# EAGLE design Adafruit PiTFT+ 3.2in (EAGLE 6.6.0)
REV: C
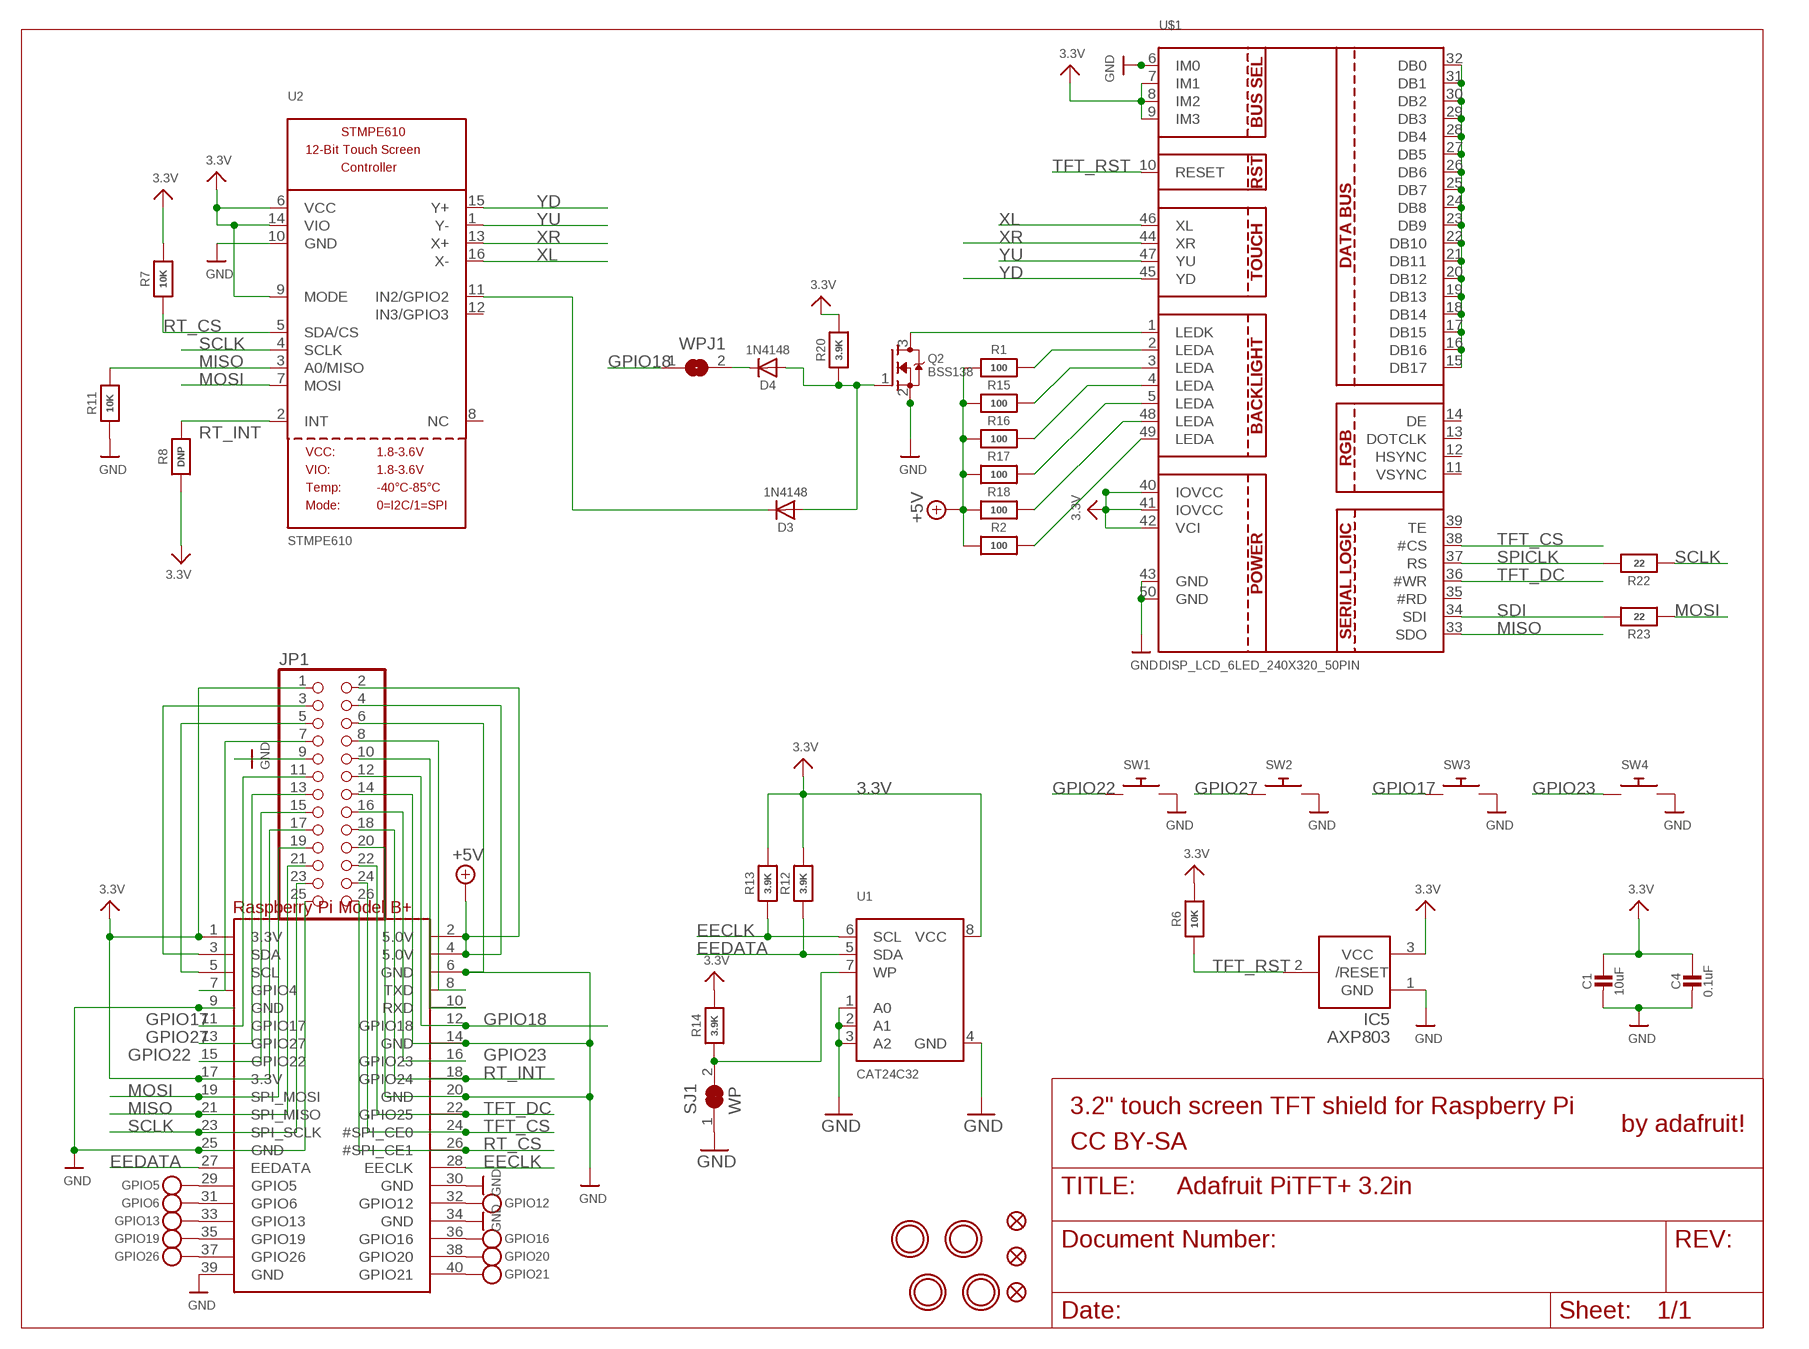
[diagram p0: schematic, sheet 1]

## Parts
C1  10uF  CAP_CERAMIC0805-NOOUTLINE  [0805-NO]
C4  0.1uF  CAP_CERAMIC0805-NOOUTLINE  [0805-NO]
D3  1N4148  DIODESOD-323  [SOD-323]
D4  1N4148  DIODESOD-323  [SOD-323]
GPIO5  TESTPOINT1.5X2.0MM_NOCREAM  [PAD-1.5X2.0]
GPIO6  TESTPOINT1.5X2.0MM_NOCREAM  [PAD-1.5X2.0]
GPIO12  TESTPOINT1.5X2.0MM_NOCREAM  [PAD-1.5X2.0]
GPIO13  TESTPOINT1.5X2.0MM_NOCREAM  [PAD-1.5X2.0]
GPIO16  TESTPOINT1.5X2.0MM_NOCREAM  [PAD-1.5X2.0]
GPIO19  TESTPOINT1.5X2.0MM_NOCREAM  [PAD-1.5X2.0]
GPIO20  TESTPOINT1.5X2.0MM_NOCREAM  [PAD-1.5X2.0]
GPIO21  TESTPOINT1.5X2.0MM_NOCREAM  [PAD-1.5X2.0]
GPIO26  TESTPOINT1.5X2.0MM_NOCREAM  [PAD-1.5X2.0]
IC5  AXP803  AXP083-SAG  [SOT23]
JP1  HEADER-2X13-SMT  [2X13_SMT_MALE]
Q2  BSS138  MOSFET-NWIDE  [SOT23-WIDE]
R1  100  RESISTOR0805_NOOUTLINE  [0805-NO]
R2  100  RESISTOR0805_NOOUTLINE  [0805-NO]
R6  10K  RESISTOR0805_NOOUTLINE  [0805-NO]
R7  10K  RESISTOR0805_NOOUTLINE  [0805-NO]
R8  DNP  RESISTOR0805_NOOUTLINE  [0805-NO]
R11  10K  RESISTOR0805_NOOUTLINE  [0805-NO]
R12  3.9K  RESISTOR0805_NOOUTLINE  [0805-NO]
R13  3.9K  RESISTOR0805_NOOUTLINE  [0805-NO]
R14  3.9K  RESISTOR0805_NOOUTLINE  [0805-NO]
R15  100  RESISTOR0805_NOOUTLINE  [0805-NO]
R16  100  RESISTOR0805_NOOUTLINE  [0805-NO]
R17  100  RESISTOR0805_NOOUTLINE  [0805-NO]
R18  100  RESISTOR0805_NOOUTLINE  [0805-NO]
R20  3.9K  RESISTOR0805_NOOUTLINE  [0805-NO]
R22  22  RESISTOR0805_NOOUTLINE  [0805-NO]
R23  22  RESISTOR_0805MP  [_0805MP]
RPI1  RASPBERRYPI_BPLUS_SMT  [RASPBERRYPI_BPLUS_SHIELD_SMT]
SJ1  WP  SOLDERJUMPER_CLOSED  [SOLDERJUMPER_CLOSEDWIRE]
SW1  SWITCH_PUSHBUTTONEVQ-PE  [TACT_PANA-EVQ]
SW2  SWITCH_PUSHBUTTONEVQ-PE  [TACT_PANA-EVQ]
SW3  SWITCH_PUSHBUTTONEVQ-PE  [TACT_PANA-EVQ]
SW4  SWITCH_PUSHBUTTONEVQ-PE  [TACT_PANA-EVQ]
U1  CAT24C32  EEPROM_I2C_SOIC8_GENERIC  [SOIC8_150MIL]
U2  STMPE610  [QFN16_3MM]
U$1  DISP_LCD_6LED_240X320_50PIN  [TFT_3.2IN_240X320_50PIN]
U$10  FIDUCIAL""  [FIDUCIAL_1MM]
U$11  FIDUCIAL""  [FIDUCIAL_1MM]
U$15  MOUNTINGHOLE2.5_THICK  [MOUNTINGHOLE_2.5_PLATED_THICK]
U$16  MOUNTINGHOLE2.5_THICK  [MOUNTINGHOLE_2.5_PLATED_THICK]
U$17  MOUNTINGHOLE2.5_THICK  [MOUNTINGHOLE_2.5_PLATED_THICK]
U$18  FIDUCIAL""  [FIDUCIAL_1MM]
U$20  MOUNTINGHOLE2.5_THICK  [MOUNTINGHOLE_2.5_PLATED_THICK]
WPJ1  SOLDERJUMPERCLOSED  [SOLDERJUMPER_CLOSEDWIRE]

## Nets
3.3V: C1.1 C4.1 IC5.3(VCC) JP1.1 JP1.17 R6.2 R7.2 R8.1 R12.2 R13.2 R14.2 R20.2 RPI1.1(3.3V) RPI1.17(3.3V) U1.8(VCC) U2.6(VCC) U2.9(MODE) U2.14(VIO) U$1.7(IM1) U$1.8(IM2) U$1.9(IM3) U$1.40(IOVCC) U$1.41(IOVCC) U$1.42(VCI)
+5V: JP1.2 JP1.4 R1.1 R2.1 R15.1 R16.1 R17.1 R18.1 RPI1.2(5.0V) RPI1.4(5.0V)
EECLK: R13.1 RPI1.28(EECLK) U1.6(SCL)
EEDATA: R12.1 RPI1.27(EEDATA) U1.5(SDA)
GND: C1.2 C4.2 IC5.1(GND) JP1.6 JP1.9 JP1.14 JP1.20 JP1.25 Q2.2(S) R11.1 RPI1.6(GND) RPI1.9(GND) RPI1.14(GND) RPI1.20(GND) RPI1.25(GND) RPI1.30(GND) RPI1.34(GND) RPI1.39(GND) SJ1.1 SW1.P$2 SW2.P$2 SW3.P$2 SW4.P$2 U1.1(A0) U1.2(A1) U1.3(A2) U1.4(GND) U2.10(GND) U$1.6(IM0) U$1.43(GND) U$1.50(GND)
GPIO6: GPIO6.P$1 RPI1.31(GPIO6)
GPIO16: GPIO16.P$1 RPI1.36(GPIO16)
GPIO17: JP1.11 RPI1.11(GPIO17) SW3.P$1
GPIO18: JP1.12 RPI1.12(GPIO18) WPJ1.1
GPIO22: JP1.15 RPI1.15(GPIO22) SW1.P$1
GPIO23: JP1.16 RPI1.16(GPIO23) SW4.P$1
GPIO27: JP1.13 RPI1.13(GPIO27) SW2.P$1
MISO: JP1.21 R11.2 RPI1.21(SPI_MISO) U2.3(A0/MISO) U$1.33(SDO)
MOSI: JP1.19 R23.1 RPI1.19(SPI_MOSI) U2.7(MOSI)
N$1: R2.2 U$1.49(LEDA)
N$2: R1.2 U$1.2(LEDA)
N$3: D3.C U2.11(IN2/GPIO2)
N$5: GPIO5.P$1 RPI1.29(GPIO5)
N$6: JP1.3 RPI1.3(SDA)
N$7: JP1.5 RPI1.5(SCL)
N$8: JP1.7 RPI1.7(GPIO4)
N$9: GPIO13.P$1 RPI1.33(GPIO13)
N$10: GPIO19.P$1 RPI1.35(GPIO19)
N$13: GPIO26.P$1 RPI1.37(GPIO26)
N$14: GPIO12.P$1 RPI1.32(GPIO12)
N$15: GPIO20.P$1 RPI1.38(GPIO20)
N$16: R14.1 SJ1.2 U1.7(WP)
N$17: JP1.10 RPI1.10(RXD)
N$18: JP1.8 RPI1.8(TXD)
N$19: GPIO21.P$1 RPI1.40(GPIO21)
N$20: D3.A D4.A Q2.1(G) R20.1
N$21: U$1.15(DB17) U$1.16(DB16) U$1.17(DB15) U$1.18(DB14) U$1.19(DB13) U$1.20(DB12) U$1.21(DB11) U$1.22(DB10) U$1.23(DB9) U$1.24(DB8) U$1.25(DB7) U$1.26(DB6) U$1.27(DB5) U$1.28(DB4) U$1.29(DB3) U$1.30(DB2) U$1.31(DB1) U$1.32(DB0)
N$22: Q2.3(D) U$1.1(LEDK)
N$23: R15.2 U$1.3(LEDA)
N$24: R16.2 U$1.4(LEDA)
N$25: R17.2 U$1.5(LEDA)
N$26: R18.2 U$1.48(LEDA)
N$28: D4.C WPJ1.2
RT_CS: JP1.26 R7.1 RPI1.26(#SPI_CE1) U2.5(SDA/CS)
RT_INT: JP1.18 R8.2 RPI1.18(GPIO24) U2.2(INT)
SCLK: JP1.23 R22.1 RPI1.23(SPI_SCLK) U2.4(SCLK)
SDI: R23.2 U$1.34(SDI)
SPICLK: R22.2 U$1.37(RS)
TFT_CS: JP1.24 RPI1.24(#SPI_CE0) U$1.38(#CS)
TFT_DC: JP1.22 RPI1.22(GPIO25) U$1.36(#WR)
TFT_RST: IC5.2(/RESET) R6.1 U$1.10(RESET)
XL: U2.16(X-) U$1.46(XL)
XR: U2.13(X+) U$1.44(XR)
YD: U2.15(Y+) U$1.45(YD)
YU: U2.1(Y-) U$1.47(YU)
Unconnected: U2.8(NC) U2.12(IN3/GPIO3) U$1.11(VSYNC) U$1.12(HSYNC) U$1.13(DOTCLK) U$1.14(DE) U$1.35(#RD) U$1.39(TE)

## Notes on the sheet
- 3.2" touch screen TFT shield for Raspberry Pi
- by adafruit!
- CC BY-SA

## Library data of the parts
C1 C4 = microbuilder:CAP_CERAMIC: Ceramic Capacitors For new designs, use the packages preceded by an '_' character since they are more reliable: The following footprints should be used on most boards: _0402 - Standard footprint for regular board layouts _0603 - Standard footprint for regular board layouts _0805 - Standard footprint for regular board layouts _1206 - Standard footprint for regular board layouts For extremely tight-pitch boards where space is at a premium, the following 'micro-pitch' footprints can be used (smaller pads, no silkscreen outline, etc.): _0402MP - Micro-pitch footprint for very dense/compact boards _0603MP - Micro-pitch footprint for very dense/compact boards _0805MP - Micro-pitch footprint for very dense/compact boards _1206MP - Micro-pitch footprint for very dense/compact boards
D3 D4 = microbuilder:DIODE: Diode SMA Model Volts Amps Type Vf Ir Digikey # Notes SSA34-E3 40V 3A Schottky 480mV @ 3A 200uA @ 40V SSA34-E3/61TGITR-ND CDBA120-G 20V 1A Schottky 500mV @ 1A 500uA @ 20V 641-1014-6-ND REEL MBRA210 10V 2A Schottky 350mV @ 2A 700uA @ 10V MBRA210LT3 SOD-123 Model Volts Amps Type Vf Ir Order # Notes BAT54T1G 30V 200mA Schottky 800mV @ 200mA 2uA @ 25V BAT54T1GOSTR-ND B0530W 30V 500mA Schottky 430mV @ 500mA 130uA @ 30V B0530W-FDICT-ND REEL MBR120 20V 1A Schottky 340mV @ 1A MBR120VLSFT1GOSCT-ND SOD-323 Model Volts Amps Type Vf Ir Order # Notes PMEG2005EJ 20V 500mA Schottky 355mV @ 500mA 568-4110-1-ND ZLLS410 10V 570mA Schottky 380mV @ 570mA ZLLS410CT-ND 1N4148WS 75V 150mA Silicon/Simple 1V 1N4148WSFSCT-ND REEL SOD-523 Model Volts Amps Type Vf Ir Order # Notes BAT54XV2 30V 200mA Schottky 0.8V @ 100mA BAT54XV2CT-ND TB751S 30V 30mA Schottky RB751S-40TE61CT-ND SOT23-R/W (R = Solder Paste/Reflow Ovens, W = Hand-Soldering) Model Volts Amps Type Vf Ir Order # Notes BAT54FILM 40V 300mA Schottky 497-7162-1-ND POWERDI-5 Model Volts Amps Type Vf Ir Order # Notes PDS560 60V 5A Schottky 670mV @ 5A 150uA @ 60V PDS560DICT-ND
GPIO5 GPIO6 GPIO12 GPIO13 GPIO16 GPIO19-GPIO21 GPIO26 = microbuilder:TESTPOINT: Test Point Various test points for characterisation and PCB testing TESTPOINT_SMT - Compact Surface Mount Test Point [Digikey: 5016KTR-ND]
IC5 = adafruit:AXP083
JP1 = microbuilder:HEADER-2X13
Q2 = microbuilder:MOSFET-N: N-Channel Mosfet LEGEND VDS: Voltage Drain-Source ID: Drain Current RDS(ON): Drain-Source On-State Resistance VGS(TH): Gate-Source Threshold Voltage CISS: Drain-Source Input Capacitance SOT-23 Name VDS ID RDS(ON) VGS(TH) CISS Order Number 2N7002E 60V 260mA 2.5 Ohm 2.5V @ 250uA 26.7pF @ 25V 2N7002ET1GOSTR-ND BSH103 30V 850mA 400 mOhm 400mV @ 1mA 83pF @ 24V BSH103,235-ND BSS138 60V 320mA 1.6 Ohm 1.5V @ 250uA 50pF @ 10V Mouser: 771-BSS138PW115 DMN2075U-7 20V 4.2A 38 mOhm 1V @ 250 uA 594.3pF @ 10V DMN2075U-7DICT-ND * BSS138 good choice for I2C level-shifting POWERPAK 1212-8 Name VDS ID RDS(ON) VGS(TH) CISS Order Number Si7308DN 60V 6A 58 mOhm 3V @ 250uA 665pF @ 15V SI7308DN-T1-E3CT-ND
R1 R2 R6-R8 R11-R18 R20 R22 R23 = microbuilder:RESISTOR: Resistors For new designs, use the packages preceded by an '_' character since they are more reliable: The following footprints should be used on most boards: _0402 - Standard footprint for regular board layouts _0603 - Standard footprint for regular board layouts _0805 - Standard footprint for regular board layouts _1206 - Standard footprint for regular board layouts For extremely tight-pitch boards where space is at a premium, the following 'micro-pitch' footprints can be used (smaller pads, no silkscreen outline, etc.): _0402MP - Micro-pitch footprint for very dense/compact boards _0603MP - Micro-pitch footprint for very dense/compact boards _0805MP - Micro-pitch footprint for very dense/compact boards _1206MP - Micro-pitch footprint for very dense/compact boards
RPI1 = microbuilder:RASPBERRYPI_BPLUS
SJ1 = microbuilder:SOLDERJUMPER_CLOSED: Solder Jumper - Closed These solder jumpers are closed by default CLOSEDWIRE - 10 mil trace between pads that can be cut and resoldered later CLOSEDPERM - 63 mil trace between pads for a permanent connection (used to 'bridge' two signals, a shameless hack for Eagle). Can double as a test point as well (no cream layer)
SW1-SW4 = microbuilder:SWITCH_PUSHBUTTON: Buttons SOFTTOUCHSMD_SJ - Soft touch temporary push button (Super Junk Akihabara) Compatible with SKPMANE010 [Mouser: 688-SKPMAN] C&K_KSS = Digikey: KSS221GLFS
U1 = microbuilder:EEPROM_I2C_SOIC8_GENERIC: Note: The same pinout is used for many I2C EEPROMs in SOIC8(150mil) from a variety of manufacturers and in various sizes. Examples: 16K (2K x 8 Bit) I2C EEPROM 1.7-5.5V, 400KHz, -40°C-85°C Digikey: CAT24C16WI-GT3CT-ND 256K (32K x 8 Bit) I2C EEPROM 1.7-5.5V, 400KHz, -40°C-85°C Digikey: 24AA256-I/SN-ND
U2 = microbuilder:STMPE610: STMPE610 - 12-Bit Touch Screen Controller
U$1 = microbuilder:DISP_LCD_6LED_240X320_50PIN
U$10 U$11 U$18 = microbuilder:FIDUCIAL: Fiducial Alignment Points Various fiducial points for machine vision alignment.; BOM: EXCLUDE
U$15-U$17 U$20 = microbuilder:MOUNTINGHOLE: Mounting Hole For #2 screws (0.086"/2.18mm width, 0.094"/2.4mm hole) use 2.5mm; BOM: EXCLUDE
WPJ1 = microbuilder:SOLDERJUMPER: SMD Solder JUMPER Solder the two pads together to create a connection, or remove the solder to break it. REFLOW - Use this footprint for solder paste and reflow ovens. WAVE - Use this footprint for hand-soldering (larger pads). CLOSED - Has a trace between the two pads to ensure it is closed by default. The trace needs to be cut to disable the jumper, and can be closed again by creating a solder bridge between the two pads.

## Board
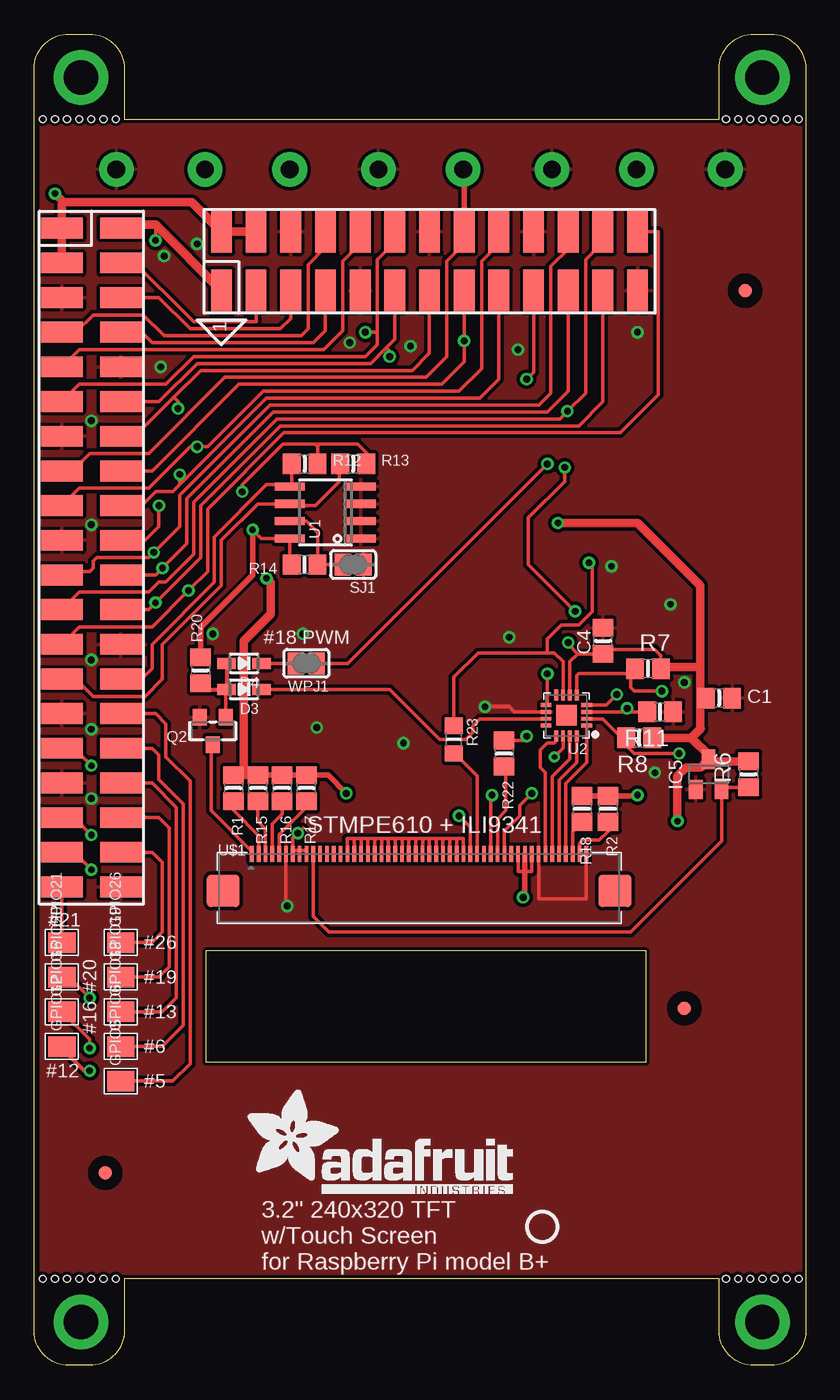
[diagram p1: board, top side]
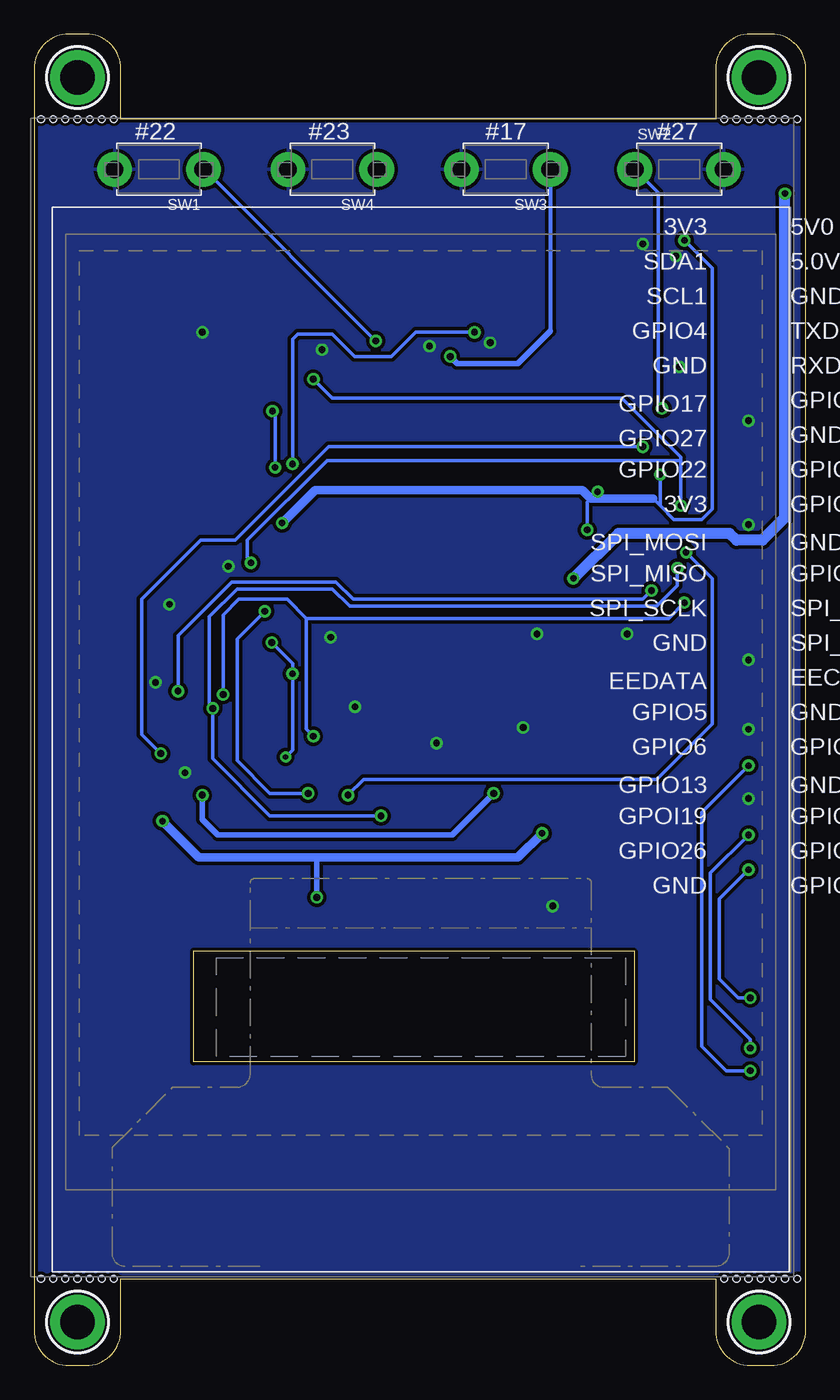
[diagram p2: board, bottom side, seen from below]

Size 56.52 x 97.54 mm. Coordinates in mm from the lower left corner, seen from the top.
Outline: 44.83,30.35 12.57,30.35 12.57,22.23 44.83,22.23 44.83,30.35
Outline: 6.6,6.35 6.6,2.54 arc-90 4.06,0 2.54,0 arc-90 0,2.54 0,95 arc-90 2.54,97.54 4.06,97.54 arc-90 6.6,95 6.6,91.31 50.16,91.31 50.16,95 arc-90 52.7,97.54 53.98,97.54 arc-90 56.52,95 56.52,2.54 arc-90 53.98,0 52.7,0 arc-90 50.16,2.54 50.16,6.35 6.6,6.35
Copper layers (1*16): Top 0.035mm / dielectric 1.5mm / Bottom 0.035mm
Design rules "adafruit *": minimum track width 8mil, minimum drill 15.5mil, track to track 8mil, track to pad 8mil, pad to pad 8mil, via to via 8mil, smd to smd 8mil, copper to edge 10mil, drill to drill 8mil, minimum pad ring 10mil, minimum via ring 8mil, stop-mask expansion 2mil, vias tented up to drill 20mil, thermal gap 10mil
Holes 0.5 mm at 5.97,91.31 5.08,91.31 4.19,91.31 3.3,91.31 2.41,91.31 1.52,91.31 0.64,91.31 56.01,91.31 55.12,91.31 54.23,91.31 53.34,91.31 52.45,91.31 51.56,91.31 50.67,91.31 5.97,6.35 5.08,6.35 4.19,6.35 3.3,6.35 2.41,6.35 1.52,6.35 0.64,6.35 56.01,6.35 55.12,6.35 54.23,6.35 53.34,6.35 52.45,6.35 51.56,6.35 50.67,6.35
tKeepout: area 23.9,39.5 to 24,39.9
tRestrict: area 19.1,37 to 19.3,37.3; area 20.1,37.3 to 20.3,37.7; area 20.6,37.3 to 20.8,37.7; area 21.1,37.3 to 21.3,37.7; area 21.6,37.3 to 21.8,37.7; area 22.1,37.3 to 22.3,37.7; area 22.6,37.3 to 22.8,37.7; area 23.1,37.3 to 23.3,37.7; area 23.6,37.3 to 23.7,37.7; area 24.1,37.3 to 24.3,37.7; area 24.6,37.3 to 24.8,37.7; area 25.1,37.3 to 25.3,37.7; 7 more areas

### Footprints (pad centres in the part's own frame; a part is rotated, then mirrored left to right if it is on the bottom)
0805-NO = smd 1.3 x 1.5: 1 -0.95,0; 2 0.95,0
SOD-323 = smd 1.35 x 0.8: A 1.27,0; C -1.27,0
PAD-1.5X2.0 = smd 1.5 x 2: P$1 0,0
SOT23 = smd 1 x 1.4: 1 -0.95,-1.1; 2 0.95,-1.1; 3 0,1.1
2X13_SMT_MALE = smd 1.524 x 3.048: 1 -15.24,-2.159; 2 -15.24,2.159; 3 -12.7,-2.159; 4 -12.7,2.159; 5 -10.16,-2.159; 6 -10.16,2.159; 7 -7.62,-2.159; 8 -7.62,2.159; 9 -5.08,-2.159; 10 -5.08,2.159; 11 -2.54,-2.159; 12 -2.54,2.159; 13 0,-2.159; 14 0,2.159; 15 2.54,-2.159; 16 2.54,2.159; 17 5.08,-2.159; 18 5.08,2.159; 19 7.62,-2.159; 20 7.62,2.159; 21 10.16,-2.159; 22 10.16,2.159; 23 12.7,-2.159; 24 12.7,2.159; 25 15.24,-2.159; 26 15.24,2.159
SOT23-WIDE = smd 1 x 1.2: 1 -0.95,-1; 2 0.95,-1; 3 0,1
_0805MP = smd 1.2 x 1.3: 1 -1.016,0; 2 1.016,0
RASPBERRYPI_BPLUS_SHIELD_SMT = smd 3.048 x 1.524 bottom: 1 50.419,76.835; 2 54.737,76.835; 3 50.419,74.295; 4 54.737,74.295; 5 50.419,71.755; 6 54.737,71.755; 7 50.419,69.215; 8 54.737,69.215; 9 50.419,66.675; 10 54.737,66.675; 11 50.419,64.135; 12 54.737,64.135; 13 50.419,61.595; 14 54.737,61.595; 15 50.419,59.055; 16 54.737,59.055; 17 50.419,56.515; 18 54.737,56.515; 19 50.419,53.975; 20 54.737,53.975; 21 50.419,51.435; 22 54.737,51.435; 23 50.419,48.895; 24 54.737,48.895; 25 50.419,46.355; 26 54.737,46.355; 27 50.419,43.815; 28 54.737,43.815; 29 50.419,41.275; 30 54.737,41.275; 31 50.419,38.735; 32 54.737,38.735; 33 50.419,36.195; 34 54.737,36.195; 35 50.419,33.655; 36 54.737,33.655; 37 50.419,31.115; 38 54.737,31.115; 39 50.419,28.575; 40 54.737,28.575
SOLDERJUMPER_CLOSEDWIRE = smd 1.168 x 1.6: 1 -0.762,0; 2 0.762,0 | smd 0.635 x 0.203: WIRE 0,0
TACT_PANA-EVQ = drill 1.3 pad 2.54: P$1 -3.25,0; P$2 3.25,0
SOIC8_150MIL = smd 0.6 x 2.2: 1 -1.905,-2.6; 2 -0.635,-2.6; 3 0.635,-2.6; 4 1.905,-2.6; 5 1.905,2.6; 6 0.635,2.6; 7 -0.635,2.6; 8 -1.905,2.6
QFN16_3MM = smd 0.8 x 0.28: 1 -1.5,0.75; 2 -1.5,0.25; 3 -1.5,-0.25; 4 -1.5,-0.75; 9 1.5,-0.75; 10 1.5,-0.25; 11 1.5,0.25; 12 1.5,0.75 | smd 0.28 x 0.8: 5 -0.75,-1.5; 6 -0.25,-1.5; 7 0.25,-1.5; 8 0.75,-1.5; 13 0.75,1.5; 14 0.25,1.5; 15 -0.25,1.5; 16 -0.75,1.5 | smd 1.5 x 1.5: THERMAL 0,0
TFT_3.2IN_240X320_50PIN = smd 0.275 x 1.2 bottom: 1 12.25,-9.39; 2 11.75,-9.39; 3 11.25,-9.39; 4 10.75,-9.39; 5 10.25,-9.39; 6 9.75,-9.39; 7 9.25,-9.39; 8 8.75,-9.39; 9 8.25,-9.39; 10 7.75,-9.39; 11 7.25,-9.39; 12 6.75,-9.39; 13 6.25,-9.39; 14 5.75,-9.39; 15 5.25,-9.39; 16 4.75,-9.39; 17 4.25,-9.39; 18 3.75,-9.39; 19 3.25,-9.39; 20 2.75,-9.39; 21 2.25,-9.39; 22 1.75,-9.39; 23 1.25,-9.39; 24 0.75,-9.39; 25 0.25,-9.39; 26 -0.25,-9.39; 27 -0.75,-9.39; 28 -1.25,-9.39; 29 -1.75,-9.39; 30 -2.25,-9.39; 31 -2.75,-9.39; 32 -3.25,-9.39; 33 -3.75,-9.39; 34 -4.25,-9.39; 35 -4.75,-9.39; 36 -5.25,-9.39; 37 -5.75,-9.39; 38 -6.25,-9.39; 39 -6.75,-9.39; 40 -7.25,-9.39; 41 -7.75,-9.39; 42 -8.25,-9.39; 43 -8.75,-9.39; 44 -9.25,-9.39; 45 -9.75,-9.39; 46 -10.25,-9.39; 47 -10.75,-9.39; 48 -11.25,-9.39; 49 -11.75,-9.39; 50 -12.25,-9.39 | smd 2.4 x 2.4 bottom: PAD1 14.35,-12.09; PAD2 -14.35,-12.09
FIDUCIAL_1MM = smd 1 x 1: 1 0,0
MOUNTINGHOLE_2.5_PLATED_THICK = drill 2.5 pad 4: P$1 0,0

### Placement (x,y rotation side)
C1  50.16,48.9 0 top
C4  41.66,53.09 90 top
D3  15.37,49.53 180 top
D4  15.37,51.44 180 top
GPIO5  6.35,20.83 90 top
GPIO6  6.35,23.37 90 top
GPIO12  2.03,23.37 90 top
GPIO13  6.35,25.91 90 top
GPIO16  2.03,25.91 90 top
GPIO19  6.35,28.45 90 top
GPIO20  2.03,28.45 90 top
GPIO21  2.03,30.99 90 top
GPIO26  6.35,30.99 90 top
IC5  49.4,43.31 0 top
JP1  28.96,80.9 0 top
Q2  13.08,46.48 180 top
R1  14.61,42.29 270 top
R2  42.04,40.77 270 top
R6  52.32,43.31 90 top
R7  44.96,51.05 0 top
R8  44.32,45.97 180 top
R11  45.85,47.88 180 top
R12  19.81,66.04 0 top
R13  23.37,66.04 0 top
R14  19.81,58.67 180 top
R15  16.38,42.29 270 top
R16  18.16,42.29 270 top
R17  19.94,42.29 270 top
R18  40.13,40.77 270 top
R20  12.19,50.93 90 top
R22  34.42,44.83 270 top
R23  30.73,45.85 270 top
RPI1  56.77,6.48 0 bottom
SJ1  23.37,58.67 180 top
SW1  47.37,87.63 180 bottom
SW2  9.27,87.63 0 bottom
SW3  21.97,87.63 180 bottom
SW4  34.67,87.63 180 bottom
U1  21.34,62.48 90 top
U2  38.99,47.62 180 top
U$1  28.19,46.86 0 bottom
U$10  47.62,26.16 90 top
U$11  5.21,14.1 180 top
U$15  3.43,3.17 90 bottom
U$16  53.34,94.36 90 bottom
U$17  53.34,3.17 0 bottom
U$18  52.07,78.74 0 top
U$19  [PCBFEAT-REV-056]  37.21,10.16 0 top
U$20  3.43,94.36 0 bottom
U$23  [ADAFRUIT_TEXT_20MM]  15.49,12.57 0 top
WPJ1  19.94,51.44 180 top

### Tracks (layer width: path | path; a pad name or v marks a point on that pad's centre or on a via)
3.3V  (via drill 0.39, 0.48, 0.5)
  Top 0.254: 45.97,51.12 R7.2 45.91,52.01 45.47,52.45 41.97,52.45 C4.1 39.82,52.14 | 39.82,52.14 39.24,51.56 U2.6 | 37.49,50.57 v37.59,50.67 37.59,48.48 U2.9 | v39.12,52.96 39.12,52.84 39.82,52.14 | IC5.3 49.55,44.26 | 10.67,64.52 10.16,64.01 8.89,64.01 7.87,62.99 RPI1.17 | 10.67,64.52 17.02,70.87 32.64,70.87 34.04,72.26 JP1.17 | 13.34,78.74 JP1.1 | C1.1 48.77,48.9 | U2.14 38.74,45.22 v38.1,44.58 | 19.7,39.38 v19.3,38.99 18.94,38.63 18.94,37.72 | 10.67,64.52 v10.67,65.28 | v8.89,82.42 8.89,83.57 | R14.2 18.74,58.8 U1.8 16.64,60.58 v16,61.21 | v15.24,64.01 15.24,64.52 18.22,67.5 20.57,67.5 | 20.57,67.5 23.69,67.5 24.38,66.8 24.38,66.11 R13.2 | R12.2 20.76,67.31 20.57,67.5 | U$1.7 18.94,37.72 | U$1.8 19.44,37.72 | 19.44,37.72 18.94,37.72 | U$1.9 19.94,37.72 19.44,37.72 | U$1.40 35.44,36.2 35.94,36.2 36.45,36.2 36.45,36.22 36.44,36.22 U$1.42
  Top 0.406: R20.2 12.19,54.1 16,57.91 v16,61.21 | U$1.41 35.94,36.2 35.94,34.42 v35.81,34.29
  Top 0.61: 48.77,51.18 48.77,57.15 44.2,61.72 v38.35,61.72 | 48.77,51.18 48.77,48.9 48.77,46.74 48.83,46.67 48.13,45.97 | v47.12,39.88 47.12,43.18 47.75,43.82 48.81,43.82 IC5.3 49.4,44.7 48.13,45.97 | 49.55,44.26 R6.2 | R8.1 48.13,45.97 | R7.2 46.03,51.18 48.77,51.18 | RPI1.1 6.6,83.57 8.89,83.57 JP1.1
  Bottom 0.254: v39.12,52.96 37.59,51.44 v37.59,50.67 37.59,45.09 v38.1,44.58 | v10.67,65.28 10.67,62.99 | 11.18,63.5 10.67,62.99 | 10.67,62.99 9.65,61.98 7.62,61.98 6.86,62.74 6.86,80.39 v8.89,82.42 | v16,61.21 16,63.25 v15.24,64.01
  Bottom 0.406: v35.81,34.29 35.81,37.08 35.69,37.21
  Bottom 0.61: v47.12,39.88 44.45,37.21 35.69,37.21 21.08,37.21 v19.3,38.99 | v38.35,61.72 35.94,64.13 16.38,64.13 15.75,63.5 14.99,63.5 | 14.99,63.5 11.18,63.5 | v15.24,64.01 15.24,63.75 14.99,63.5
+5V  (via drill 0.48, 0.5)
  Top 0.406: R1.1 15.49,43.24 R15.1 R16.1 R17.1 21.53,43.24 v22.86,41.91 | R18.1 R2.1 44.13,41.72 v44.2,41.78
  Top 0.61: RPI1.4 RPI1.2 2.03,85.09 2.16,85.22 | 2.16,85.22 11.56,85.22 JP1.2 JP1.4 | v1.52,85.85 2.16,85.22 | v17.02,57.66 17.33,57.34 17.33,55.05 15.37,53.09 15.37,43.37 15.49,43.24
  Bottom 0.406: v22.86,41.91 25.91,38.86 43.05,38.86 44.2,40.01 v44.2,41.78
  Bottom 0.813: v1.52,85.85 1.52,62.1 3.17,60.45 5.08,60.45 5.59,60.96 13.72,60.96 v17.02,57.66
EECLK
  Top 0.254: RPI1.28 3.05,50.29 4.32,49.02 8.13,49.02 9.4,50.29 9.4,52.83 13.72,57.15 13.72,60.45 16.38,63.12 U1.6 18.86,62.99 20.57,62.99 22.35,64.77 22.35,66.04 R13.1
EEDATA
  Top 0.254: RPI1.27 7.87,50.29 8.64,51.05 8.64,52.83 13.21,57.4 13.21,60.71 17.02,64.52 18.61,64.52 U1.5 | 18.61,64.26 U1.5 | R12.1 18.86,64.39 U1.5
GND  (via drill 0.48, 0.5)
  Top 0.254: U2.10 35.17,47.88 34.79,48.26 v33.02,48.26 | U$1.6 18.44,33.66 v18.54,33.66 | U$1.50 40.44,34.16 36.96,34.16 36.96,35.94 36.96,36.22 36.96,37.46 U$1.43
  other vias: 34.8,53.34 46.61,55.75 42.29,58.55 45.47,43.43 20.7,46.74 19.68,53.59 4.19,69.22 9.27,73.15 9.53,81.28 11.94,82.17 23.11,74.93 27.56,74.68 35.43,74.42 44.2,75.69 27.05,45.59 47.62,50.04 4.19,61.59 4.19,51.69 4.19,46.61 4.19,41.53 13.08,53.59
  pour Top (isolate 0.254): 0.51,6.35 0.51,91.44 56.39,91.44 56.39,6.35
  pour Bottom (isolate 0.254): 0.51,6.35 0.51,91.44 56.39,91.44 56.39,6.35
GPIO6
  Top 0.254: GPIO6.P$1 9.4,23.37 10.92,24.89 10.92,41.15 9.14,42.93 9.14,44.7 8.64,45.21 RPI1.31
GPIO16  (via drill 0.48)
  Top 0.254: RPI1.36 2.92,40.13 v4.19,38.86 | GPIO16.P$1 4.06,23.88 v4.06,23.24
  Bottom 0.254: v4.19,38.86 6.99,36.07 6.99,26.8 4.06,23.88 v4.06,23.24
GPIO17  (via drill 0.5)
  Top 0.254: 25.78,74.55 24.64,73.41 11.94,73.41 9.14,70.61 RPI1.11 | 25.78,74.55 26.42,75.18 JP1.11 | v26.04,73.91 26.04,74.29 25.78,74.55
  Bottom 0.305: SW3.P$1 18.72,75.77
  Bottom 0.406: 18.72,75.77 18.99,75.5 21.08,73.41 25.53,73.41 v26.04,73.91
GPIO18  (via drill 0.5)
  Top 0.254: JP1.12 26.42,82.3 25.15,81.03 25.15,75.69 | 25.15,75.69 25.15,74.8 24.26,73.91 11.68,73.91 9.65,71.88 3.3,71.88 RPI1.12 | v24.26,75.69 25.15,75.69 | WPJ1.1 22.99,51.44 v37.59,66.04
  Bottom 0.254: v37.59,66.04 37.59,75.18 37.21,75.56 34.67,75.56 33.02,73.91 30.35,73.91 28.57,75.69 v24.26,75.69
GPIO22  (via drill 0.5)
  Top 0.254: JP1.15 v31.5,75.06 31.5,73.53 29.84,71.88 14.99,71.88 8.64,65.53 RPI1.15
  Bottom 0.254: 44.07,87.63 v31.5,75.06
  Bottom 0.305: 44.07,87.63 SW1.P$1
GPIO23
  Top 0.254: JP1.16 31.24,82.8 31.24,81.91 30.23,80.9 30.23,73.91 28.7,72.39 13.97,72.39 8.38,66.8 4.06,66.8 2.54,65.28 2.29,65.28 RPI1.16
  Top 0.305: 31.5,87.55 SW4.P$1
  Top 0.406: 31.5,87.55 JP1.16
GPIO27  (via drill 0.5)
  Top 0.254: JP1.13 28.96,74.17 27.69,72.9 12.19,72.9 10.22,70.93 | 10.22,70.93 7.37,68.07 RPI1.13 | v10.54,70.1 10.54,70.61 10.22,70.93
  Bottom 0.254: v10.54,70.1 10.79,70.36 10.79,85.9 SW2.P$1
MISO  (via drill 0.48, 0.5)
  Top 0.254: U2.3 43.18,47.88 v43.43,48.13 43.69,47.88 R11.2 | JP1.21 39.12,71.37 37.59,69.85 17.53,69.85 11.18,63.5 11.18,60.2 v9.4,58.42 8.89,57.91 RPI1.21 | U$1.33 31.94,39.43 v31.11,40.26
  Bottom 0.254: v9.4,58.42 9.4,57.15 10.92,55.63 33.4,55.63 34.67,56.9 41.66,56.9 43.69,54.86 43.69,48.39 v43.43,48.13 43.43,44.45 39.24,40.26 v31.11,40.26
MOSI  (via drill 0.48, 0.5)
  Top 0.254: 37.59,52.2 38.1,52.2 38.74,51.56 U2.7 | v40.64,58.8 40.89,58.55 40.89,55.25 39.88,54.23 38.61,54.23 37.59,53.21 37.59,52.2 | JP1.19 36.58,72.77 v36.07,72.26 | RPI1.19 8.13,60.45 9.14,61.47 v9.14,62.99 | R23.1 30.73,50.42 32.51,52.2 37.59,52.2
  Bottom 0.254: v40.64,58.8 40.51,58.8 40.89,59.18 40.89,60.45 35.05,66.29 9.14,66.29 | v9.14,62.99 9.14,66.29 | 9.14,66.29 9.14,66.55 13.46,70.87 34.67,70.87 v36.07,72.26
N$1
  Top 0.254: U$1.49 39.94,38.29 40.13,38.48 41.4,38.48 42.04,39.12 R2.2
N$2
  Top 0.254: U$1.2 16.44,38.8 14.61,40.64 R1.2
N$3
  Top 0.254: U2.11 32.64,47.38 32.13,46.86 32.13,46.36 31.62,45.85 29.72,45.85 26.04,49.53 D3.C
N$5
  Top 0.254: GPIO5.P$1 10.16,20.83 11.43,22.1 11.43,42.8 9.65,44.58 9.65,46.99 8.89,47.75 RPI1.29
N$6
  Top 0.254: JP1.3 16.26,76.45 11.68,76.45 6.86,81.28 RPI1.3
N$7
  Top 0.254: JP1.5 18.8,76.71 18.03,75.95 11.43,75.95 9.14,78.23 RPI1.5
N$8
  Top 0.254: JP1.7 21.34,75.82 20.45,74.93 8.64,74.93 7.87,75.69 RPI1.7
N$9
  Top 0.254: GPIO13.P$1 9.4,25.91 10.41,26.92 10.41,40.89 8.64,42.67 RPI1.33
N$10
  Top 0.254: GPIO19.P$1 9.14,28.45 9.91,29.21 9.91,39.37 9.14,40.13 RPI1.35
N$13
  Top 0.254: GPIO26.P$1 8.64,30.99 9.4,31.75 9.4,36.83 8.64,37.59 RPI1.37
N$14  (via drill 0.48)
  Top 0.254: RPI1.32 2.92,45.21 v4.19,43.94 | 3.68,21.59 v4.06,21.59
  Top 0.305: 3.68,21.59 2.03,23.24 GPIO12.P$1
  Bottom 0.254: v4.19,43.94 7.62,40.51 7.62,23.37 5.84,21.59 v4.06,21.59
N$15  (via drill 0.48)
  Top 0.254: RPI1.38 2.92,37.59 v4.19,36.32 | GPIO20.P$1 2.54,28.45 v4.06,26.92
  Bottom 0.254: v4.19,36.32 6.35,34.16 6.35,28.32 4.95,26.92 v4.06,26.92
N$16
  Top 0.254: U1.7 19.94,61.85 20.76,61.03 R14.1 SJ1.2
N$17
  Top 0.254: JP1.10 23.88,82.17 22.61,80.9 22.61,75.82 21.21,74.42 3.3,74.42 RPI1.10
N$18
  Top 0.254: JP1.8 21.34,81.91 20.07,80.64 20.07,75.95 19.56,75.44 9.53,75.44 8,76.96 4.32,76.96 3.05,75.69 RPI1.8
N$19
  Top 0.254: RPI1.40 GPIO21.P$1
N$20
  Top 0.254: Q2.1 14.03,49.46 | R20.1 12.64,49.53
  Top 0.305: D4.A D3.A | 12.64,49.53 D3.A | D3.A 14.03,49.46
N$21
  Top 0.254: U$1.15 22.94,38.61 23.44,38.61 | 23.94,38.61 24.44,38.61 | 24.44,38.61 24.94,38.61 | 24.94,38.61 25.44,38.61 | 25.44,38.61 25.94,38.61 | 25.94,38.61 26.44,38.61 | 26.44,38.61 26.94,38.61 | 26.94,38.61 27.44,38.61 | 27.44,38.61 27.94,38.61 | 27.94,38.61 28.44,38.61 | 28.44,38.61 28.94,38.61 | 28.94,38.61 29.44,38.61 | 29.44,38.61 29.94,38.61 | 29.94,38.61 30.44,38.61 | 30.94,38.61 31.44,38.61 U$1.32 | U$1.31 30.94,38.61 | 30.94,38.61 30.44,38.61 | U$1.30 30.44,38.61 | U$1.29 29.94,38.61 | U$1.28 29.44,38.61 | U$1.27 28.94,38.61 | U$1.26 28.44,38.61 | U$1.25 27.94,38.61 | U$1.24 27.44,38.61 | U$1.23 26.94,38.61 | U$1.22 26.44,38.61 | U$1.21 25.94,38.61 | U$1.20 25.44,38.61 | U$1.19 24.94,38.61 | U$1.18 24.44,38.61 | U$1.17 23.94,38.61 | 23.94,38.61 23.44,38.61 | U$1.16 23.44,38.61
N$22
  Top 0.254: U$1.1 15.94,37.65 12.95,40.64 12.95,45.36 Q2.3
N$23
  Top 0.254: U$1.3 16.94,39.32 16.38,39.88 R15.2
N$24
  Top 0.254: U$1.4 17.44,39.67 18.16,40.39 R16.2
N$25
  Top 0.254: U$1.5 17.94,38.9 19.94,40.89 R17.2
N$26
  Top 0.254: U$1.48 39.44,39.13 R18.2
N$28
  Top 0.254: WPJ1.2 D4.C
RT_CS  (via drill 0.48, 0.5)
  Top 0.254: v45.97,49.4 43.94,49.4 43.69,49.66 43.69,50.73 R7.1 43.63,50.67 39.88,50.67 39.74,50.53 U2.5 | JP1.26 45.72,83.06 45.72,71.12 42.93,68.33 18.29,68.33 12.7,62.74 12.7,58.17 v11.3,56.77 8.64,54.1 3.3,54.1 RPI1.26
  Bottom 0.254: v45.97,49.4 45.97,53.47 42.04,57.4 34.42,57.4 33.15,56.13 11.94,56.13 v11.3,56.77
RT_INT  (via drill 0.48, 0.5)
  Top 0.254: U2.2 41.65,47.38 43.05,45.97 R8.2 43.37,45.4 43.94,44.83 v47.24,44.83 | JP1.18 34.04,82.17 32.77,80.9 32.77,73.02 31.11,71.37 16.76,71.37 12.7,67.31 v11.94,67.31 11.43,67.31 8.38,64.26 3.3,64.26 RPI1.18
  Bottom 0.254: v11.94,67.31 34.92,67.31 41.78,60.45 44.32,60.45 48.64,56.13 48.64,46.23 v47.24,44.83
SCLK  (via drill 0.48, 0.5)
  Top 0.254: U2.4 41.9,48.38 v42.67,49.15 | JP1.23 41.66,70.61 39.88,68.83 18.03,68.83 12.19,62.99 12.19,59.18 v8.89,55.88 8.38,55.37 RPI1.23 | R22.1 35.75,45.78 v36.07,46.1
  Bottom 0.254: v42.67,49.15 42.67,54.99 41.53,56.13 37.97,56.13 36.58,54.74 | v36.07,46.1 36.58,46.61 36.58,54.74 | v8.89,55.88 10.03,54.74 36.58,54.74
SDI
  Top 0.254: U$1.34 32.44,43.19 30.8,44.83 R23.2
SPICLK
  Top 0.254: U$1.37 33.94,40.04 34.54,40.64 34.54,43.75 R22.2
TFT_CS  (via drill 0.48, 0.5)
  Top 0.254: v36.45,41.91 35.56,41.02 35.56,40.26 34.44,39.14 U$1.38 | v39.62,55.25 36.2,58.67 36.2,62.1 38.86,64.77 v38.86,65.79 | JP1.24 41.4,82.8 41.4,82.04 40.39,81.03 40.39,71.25 v39.05,69.91 38.48,69.34 17.78,69.34 11.68,63.25 11.68,59.44 9.65,57.4 9.14,57.4 8.38,56.64 3.3,56.64 RPI1.24
  Bottom 0.254: v36.45,41.91 39.24,41.91 41.66,44.32 41.66,53.21 v39.62,55.25 | v38.86,65.79 38.86,69.72 v39.05,69.91
TFT_DC  (via drill 0.48, 0.5)
  Top 0.254: JP1.22 39.12,81.79 37.85,80.52 37.85,71.25 36.96,70.36 17.27,70.36 10.67,63.75 10.67,61.47 v8.76,59.56 8.38,59.18 4.57,59.18 4.32,58.93 4.32,58.42 4.06,58.17 2.29,58.17 RPI1.22 | U$1.36 33.44,41.7 v33.53,41.78
  Bottom 0.254: v33.53,41.78 32.38,42.93 10.92,42.93 6.86,46.99 6.86,57.66 v8.76,59.56
TFT_RST
  Top 0.254: R6.1 50.5,42.36 IC5.2 50.35,38.41 43.69,31.75 21.59,31.75 20.44,32.9 U$1.10
XL
  Top 0.254: U2.16 39.74,44.18 38.44,42.89 U$1.46
XR
  Top 0.254: U2.13 38.24,45.73 38.1,45.59 37.59,45.59 37.08,45.09 37.08,43.82 37.44,43.45 U$1.44
YD
  Top 0.254: U2.15 39.24,44.45 37.94,43.15 U$1.45
YU
  Top 0.254: U2.1 40.49,44.17 38.94,42.63 U$1.47

### Text on the board
tPlace: 1 | #18 PWM | STMPE610 + ILI9341 | #21 | #26 | #19 | #20 | #13 | #16 | #6 | #12 | #5 | 3.2" 240x320 TFT / w/Touch Screen / for Raspberry Pi model B+
bPlace: #27 | #17 | #23 | #22